# Altium schematic sheet Shutdown_Circuit.SchDoc
size Tabloid
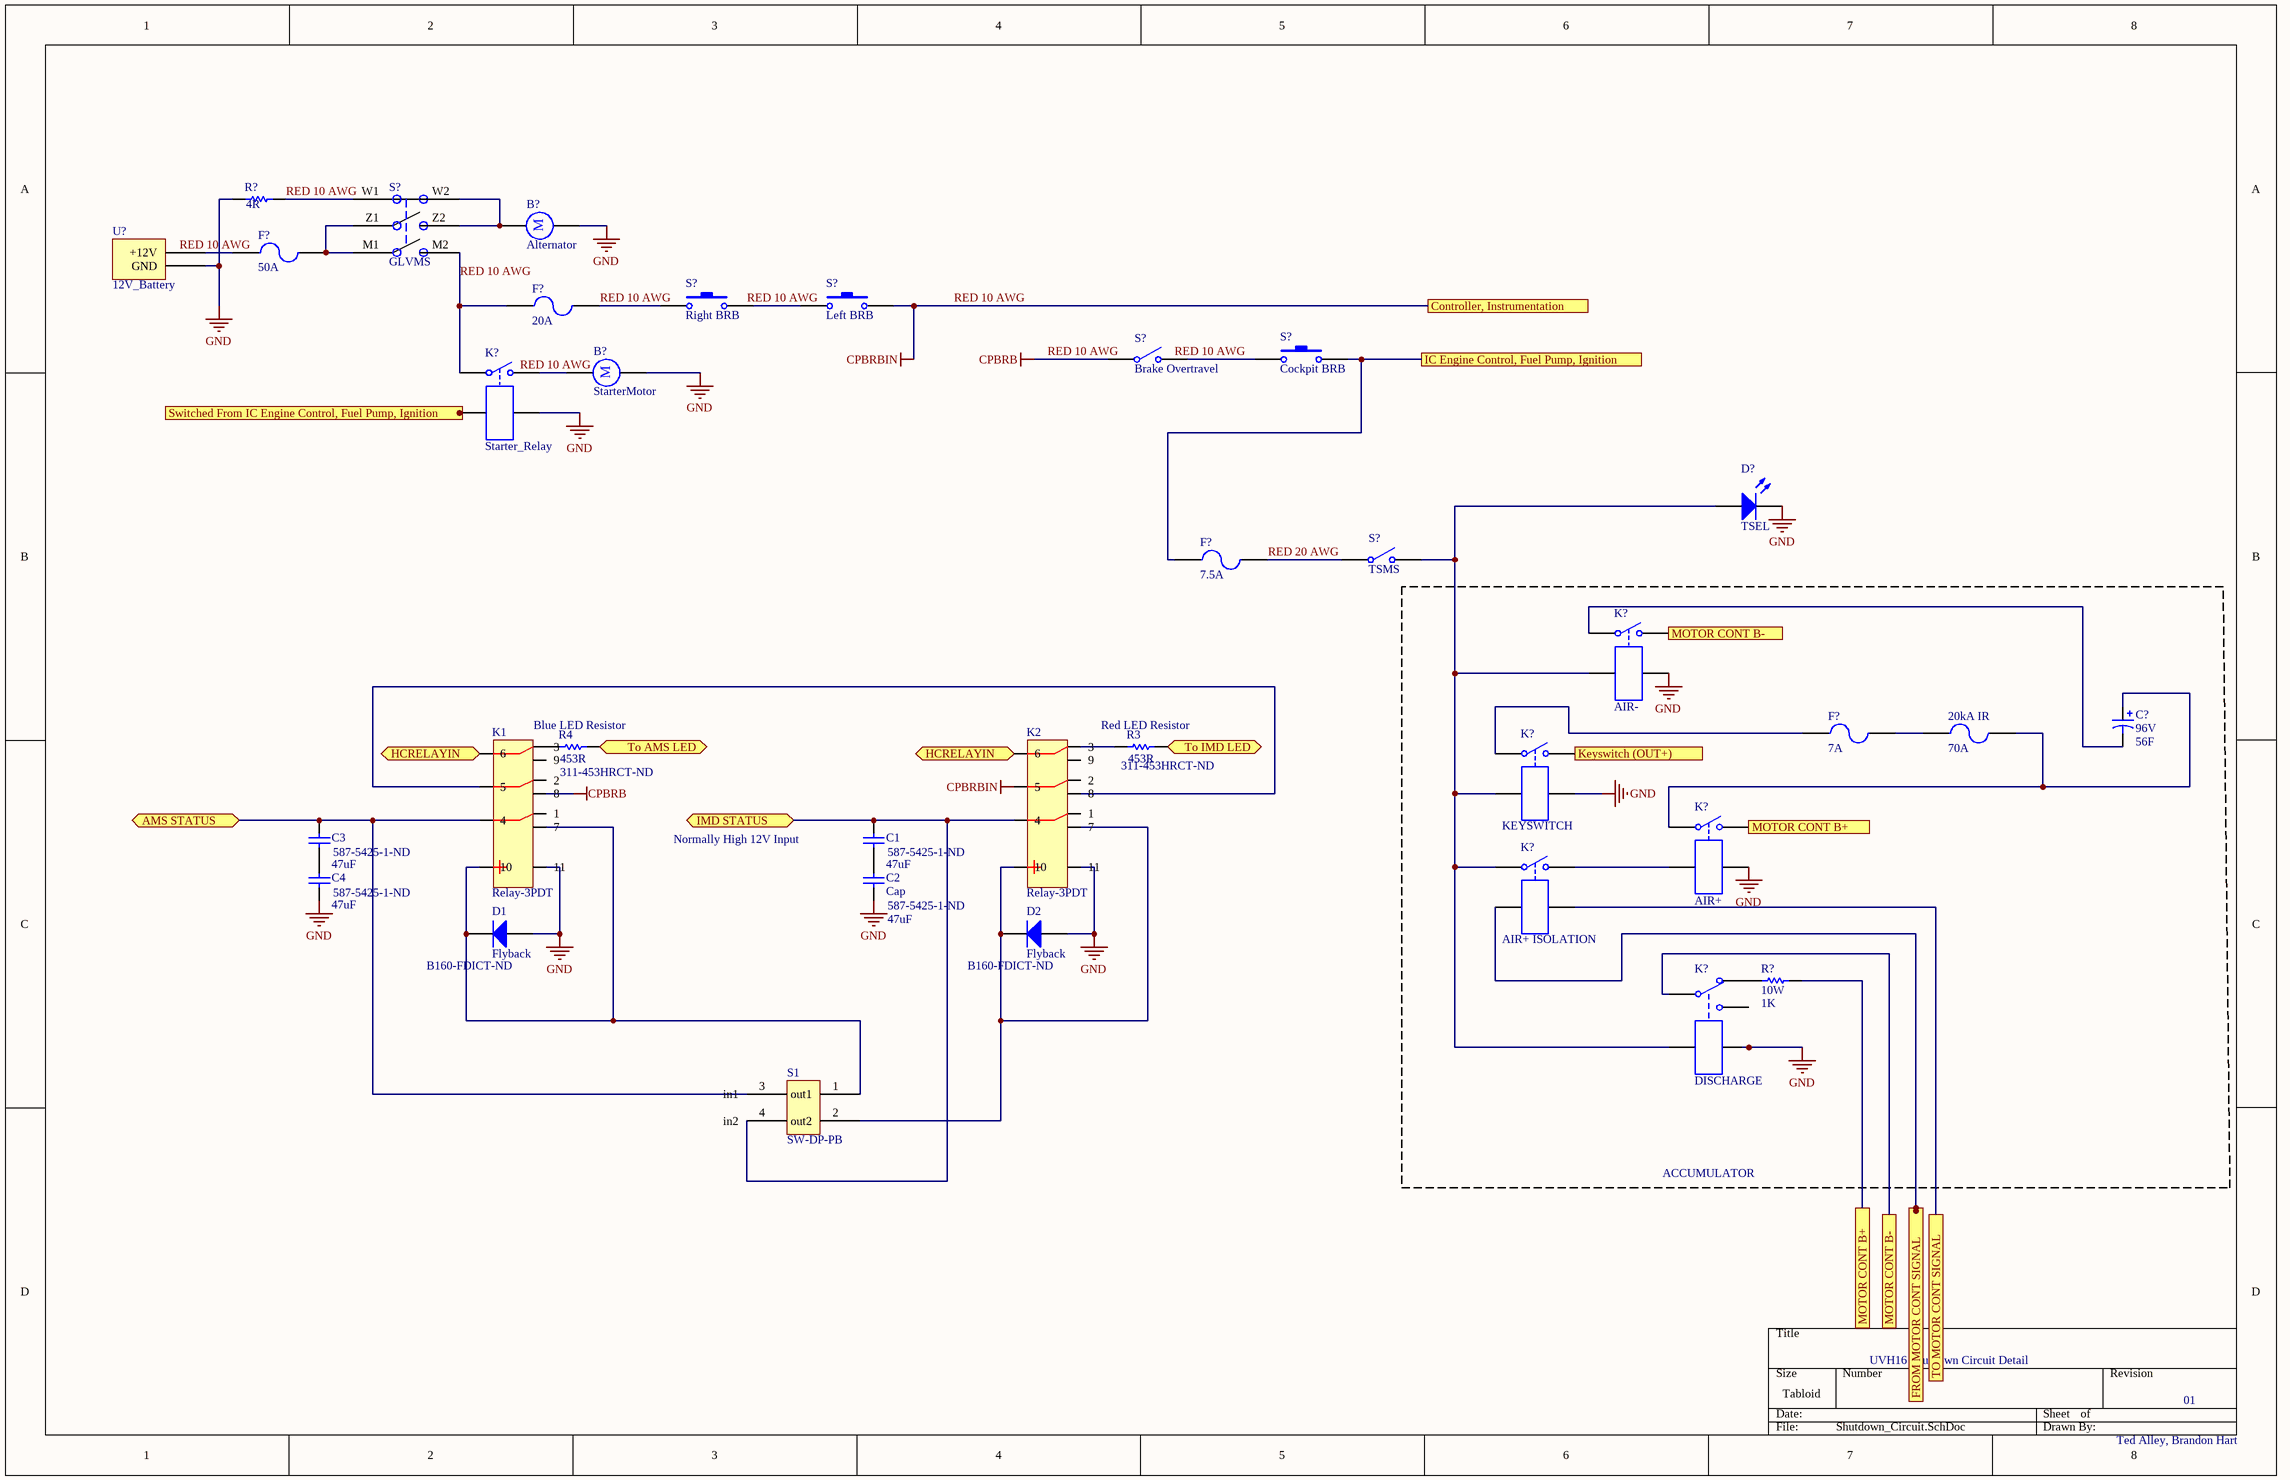
[diagram p0: Shutdown_Circuit.SchDoc]

## Parts
(Parts that share a designator on the sheet are numbered #1, #2 ... from top to bottom, then left to right.)
20kA_IR  70A
B?#1  Alternator  [RB5-10.5]
B?#2  StarterMotor
C1  value 47uF  Supplier Part Number 1: 587-5425-1-ND  [1206 (High Density)]  (hidden comment: Cap)
C2  Cap  value 47uF  Supplier Part Number 1: 587-5425-1-ND  [C1206]
C3  value 47uF  Supplier Part Number 1: 587-5425-1-ND  [C1206]  (hidden comment: Cap)
C4  value 47uF  Supplier Part Number: 587-5425-1-ND  [C1206]  (hidden comment: Cap)
C?  96V  value 56F  [RB7.6-15]
D1  Flyback  Supplier Part Number 1: B160-FDICT-ND  [SOD-123]
D2  Flyback  Supplier Part Number 1: B160-FDICT-ND  [SOD-123]
D?  TSEL  [LED-0]
F?#1  50A
F?#2  20A  [PIN-W2/E2.8]
F?#3  7.5A
F?#4  7A
K1  Relay-3PDT
K2  Relay-3PDT
K?#1  Starter_Relay  [MODULE4]
K?#2  AIR-  [MODULE4]
K?#3  KEYSWITCH  [MODULE4]
K?#4  AIR+  [MODULE4]
K?#5  AIR+ ISOLATION  [MODULE4]
K?#6  DISCHARGE  [MODULE5B]
R3  Red LED Resistor  value 453R  Supplier Part Number 1: 311-453HRCT-ND  [0603]
R4  Blue LED Resistor  value 453R  Supplier Part Number 1: 311-453HRCT-ND  [0603]
R?#1  value 4R  [AXIAL-0.3]  (hidden comment: Res1)
R?#2  10W  value 1K  [AXIAL-0.3]
S1  SW-DP-PB
S?#1  GLVMS
S?#2  Right BRB
S?#3  Left BRB
S?#4  Brake Overtravel
S?#5  Cockpit BRB
S?#6  TSMS
U?  12V_Battery

## Blocks framed on the sheet
ACCUMULATOR: 20kA_IR C? F?#4 K?#2-K?#6 R?#2

## Ports
AMS STATUS (bidir), Controller, Instrumentation, FROM MOTOR CONT SIGNAL, HCRELAYIN (bidir), IC Engine Control, Fuel Pump, Ignition, IMD STATUS (bidir), Keyswitch (OUT+), MOTOR CONT B+, MOTOR CONT B-, Switched From IC Engine Control, Fuel Pump, Ignition, To AMS LED (bidir), To IMD LED (bidir), TO MOTOR CONT SIGNAL

## Nets
GND: B?#1.2 B?#2.2 C2.1 C4.1 D1.1(A) D2.1(A) D?.2(K) K?#1.4 K?#2.4 K?#3.4 K?#4.4 K?#6.5 R?#1.1 U?.2(GND)
RED 10 AWG: F?#2.1 F?#2.2 K2.5 K?#1.1 R?#1.2 S?#1.M2 S?#1.W1 S?#2.1 S?#3.2 S?#4.1(COMMON) ; port Controller, Instrumentation  [also labelled CPBRB, CPBRBIN]
AMS STATUS: C3.2 K1.4 ; port AMS STATUS
FROM MOTOR CONT SIGNAL: K?#5.3 ; port FROM MOTOR CONT SIGNAL
HCRELAYIN: K1.6 K2.6 ; port HCRELAYIN
IC Engine Control, Fuel Pump, Ignition: F?#3.1 S?#5.2 ; port IC Engine Control, Fuel Pump, Ignition
IMD STATUS: C1.2 K2.4 ; port IMD STATUS
Keyswitch (OUT+): K?#3.2 ; port Keyswitch (OUT+)
MOTOR CONT B+: K?#4.2 R?#2.2 ; port MOTOR CONT B+
MOTOR CONT B-: K?#2.2 K?#6.1 ; port MOTOR CONT B-
RED 20 AWG: F?#3.2 S?#6.1(COMMON)
To AMS LED: R4.1 ; port To AMS LED
To IMD LED: R3.1 ; port To IMD LED
TO MOTOR CONT SIGNAL: K?#5.4 ; port TO MOTOR CONT SIGNAL
Net20kA_IR_1: 20kA_IR.1 F?#4.2
Net20kA_IR_2: 20kA_IR.2 C?.1 K?#4.1
NetB?#1_1: B?#1.1 S?#1.W2 S?#1.Z2
NetB?#2_1: B?#2.1 K?#1.2
NetC1_1: C1.1 C2.2
NetC3_1: C3.1 C4.2
NetC?_2: C?.2 K?#2.1
NetD1_2: D1.2(K) K1.10 S1.1(out1)
NetD2_2: D2.2(K) K2.10 S1.2(out2)
NetD?_1: D?.1(A) K?#2.3 K?#3.3 K?#5.1 K?#6.4 S?#6.2(NO)
NetF?#1_1: F?#1.1 U?.1(+12V)
NetF?#1_2: F?#1.2 S?#1.M1 S?#1.Z1
NetF?#4_1: F?#4.1 K?#3.1
NetK?#4_3: K?#4.3 K?#5.2
NetK?#6_2: K?#6.2 R?#2.1
NetS?#2_2: S?#2.2 S?#3.1
NetS?#4_2: S?#4.2(NO) S?#5.1

Not connected (* = marked no-connect by the designer): K1 1 2 3 5 7 8 9 11; K2 1 2 3 7 8 9 11; K?#1 3; K?#6 3; R3 2; R4 2; S1 3(in1) 4(in2)

## Notes on the sheet
- Normally High 12V Input
- UVH16 Shutdown Circuit Detail
- 01
- Ted Alley, Brandon Hart
- Labels drawn without touching a wire or pin: RED 10 AWG
- (in symbol Motor) M

## Library data of the parts
20kA_IR F?#1-F?#4 = Fuse 2: Fuse; Published: 8-Jun-2000; LatestRevisionDate: 17-Jul-2002; LatestRevisionNote: Re-released for DXP Platform.; PackageReference: PIN-W2/E2.8; Publisher: Altium Limited; PackageDescription: Thru-Hole; 2 Leads
B?#1 B?#2 = Motor: Motor, General Kind; Published: 24-Mar-1999; LatestRevisionDate: 17-Jul-2002; LatestRevisionNote: Re-released for DXP Platform.; Publisher: Altium Limited
  B?#1: PackageReference: RB5-10.5; PackageDescription: Capacitor (Radial); 2 Leads
C1-C4 = Cap: Capacitor; Published: 8-Jun-2000; LatestRevisionDate: 17-Jul-2002; LatestRevisionNote: Re-released for DXP Platform.; PackageReference: RAD-0.3; Publisher: Altium Limited; PackageDescription: Radial Cap, Thru-Hole; 2 Leads; 0.3 in Pin Spacing
C? = Cap Pol1: Polarized Capacitor (Radial); Published: 8-Jun-2000; LatestRevisionDate: 17-Jul-2002; LatestRevisionNote: Re-released for DXP Platform.; PackageReference: RB7.6-15; Publisher: Altium Limited; PackageDescription: Polarized Capacitor (Radial); 2 Leads
D1 D2 = Diode: Default Diode; Published: 8-Jun-2000; LatestRevisionDate: 17-Jul-2002; LatestRevisionNote: Re-released for DXP Platform.; PackageVersion: Sep-1996; PackageReference: SMC; Publisher: Altium Limited; PackageDescription: DO-214-AB/SMC; 2 C-Bend Leads; Body 7.9 x 5.9 mm, inc. leads (LxW); Code_JEDEC: DO-214-AB; Supplier 1: Digi-Key
D? = LED0: Typical INFRARED GaAs LED; Published: 8-Jun-2000; LatestRevisionDate: 08-Jul-2005; LatestRevisionNote: Mech Layer 1 removed.; PackageReference: LED-0; Publisher: Altium Limited; PackageDescription: LED; 2 Leads
K?#1-K?#5 = Relay-SPST: Single-Pole Single-Throw Relay; Published: 24-Mar-1999; LatestRevisionDate: 17-Jul-2002; LatestRevisionNote: Re-released for DXP Platform.; PackageReference: MODULE4; Publisher: Altium Limited
K?#6 = Relay-SPDT: Single-Pole Dual-Throw Relay; Published: 24-Mar-1999; LatestRevisionDate: 17-Jul-2002; LatestRevisionNote: Re-released for DXP Platform.; PackageReference: MODULE5B; Publisher: Altium Limited
R3 R4 R?#1 R?#2 = Res1: Resistor; Published: 8-Jun-2000; LatestRevisionDate: 17-Jul-2002; LatestRevisionNote: Re-released for DXP Platform.; PackageReference: AXIAL-0.3; Publisher: Altium Limited; PackageDescription: Axial Device, Thru-Hole; 2 Leads; 0.3 in Pin Spacing
  R3 R4: Supplier 1: Digi-Key
S?#2 S?#3 S?#5 = SW-PB: Switch; Published: 24-Mar-1999; LatestRevisionDate: 17-Jul-2002; LatestRevisionNote: Re-released for DXP Platform.; PackageReference: SPST-2; Publisher: Altium Limited; PackageDescription: Switch; 2 Leads
S?#4 S?#6 = SW-SPST: Single-Pole, Single-Throw Switch; Published: 24-Mar-1999; LatestRevisionDate: 17-Jul-2002; LatestRevisionNote: Re-released for DXP Platform.; PackageReference: SPST-2; Publisher: Altium Limited; PackageDescription: Switch; 2 Leads
K1 K2 = Relay-3PDT: ComponentLink1Description: Manufacturer Link; ComponentLink2Description: Datasheet